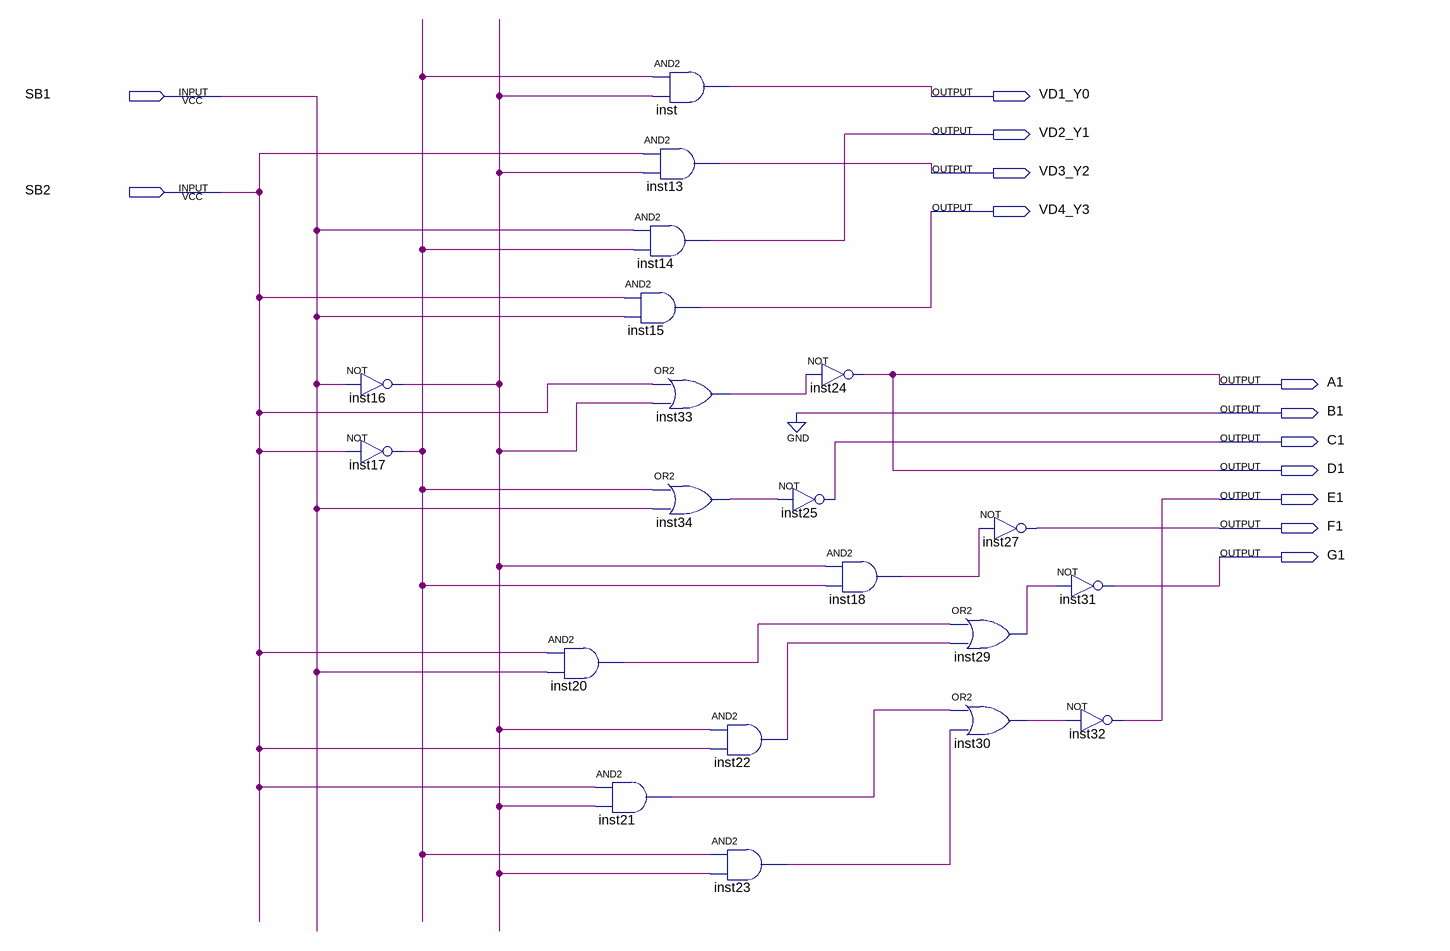
[diagram p0: schematic sheet]
// Quartus schematic Project_6.bdf as structural Verilog: 20 symbols, 13 pins
module Project_6 (
  input  SB1,
  input  SB2,
  output VD1_Y0,
  output VD2_Y1,
  output VD3_Y2,
  output VD4_Y3,
  output A1,
  output B1,
  output C1,
  output D1,
  output E1,
  output F1,
  output G1
);

  wire inst16_out, inst17_out, inst18_out, inst20_out, inst21_out, inst22_out, inst23_out, inst29_out,
       inst30_out, inst33_out, inst34_out;

  not inst16 (inst16_out, SB1);
  not inst17 (inst17_out, SB2);
  and inst20 (inst20_out, SB2, SB1);
  and inst21 (inst21_out, SB2, inst16_out);
  and inst (VD1_Y0, inst17_out, inst16_out);
  and inst13 (VD3_Y2, SB2, inst16_out);
  and inst14 (VD2_Y1, SB1, inst17_out);
  and inst15 (VD4_Y3, SB2, SB1);
  or inst33 (inst33_out, SB2, inst16_out);
  or inst34 (inst34_out, inst17_out, SB1);
  and inst22 (inst22_out, inst16_out, SB2);
  and inst23 (inst23_out, inst17_out, inst16_out);
  not inst24 (A1, inst33_out);
  not inst25 (C1, inst34_out);
  and inst18 (inst18_out, inst16_out, inst17_out);
  not inst27 (F1, inst18_out);
  or inst29 (inst29_out, inst20_out, inst22_out);
  or inst30 (inst30_out, inst21_out, inst23_out);
  not inst31 (G1, inst29_out);
  not inst32 (E1, inst30_out);

  assign B1 = 1'b0;
  assign D1 = A1;
endmodule
